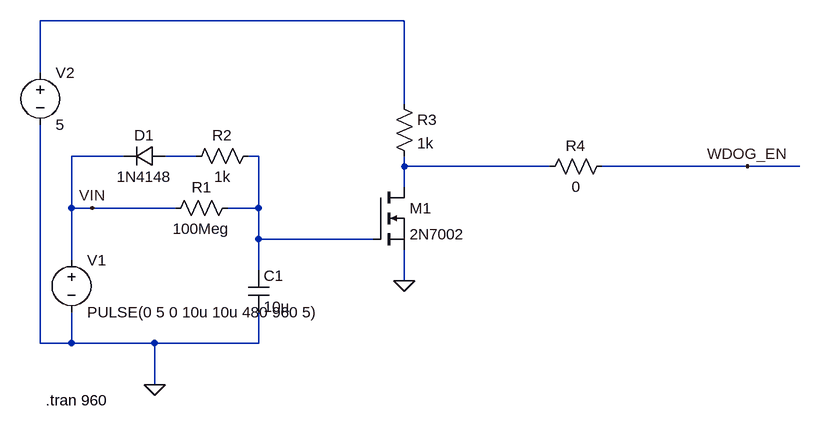
[diagram p0: schematic WDT fast deassert.asc]
WDT fast deassert.asc, the LTspice schematic file:
Version 4.1
SHEET 1 1172 680
WIRE 560 -224 0 -224
WIRE 0 -144 0 -224
WIRE 560 -96 560 -224
WIRE 128 -16 48 -16
WIRE 240 -16 192 -16
WIRE 336 -16 320 -16
WIRE 560 0 560 -16
WIRE 784 0 560 0
WIRE 1088 0 864 0
WIRE 1168 0 1088 0
WIRE 560 32 560 0
WIRE 48 64 48 -16
WIRE 80 64 48 64
WIRE 208 64 80 64
WIRE 336 64 336 -16
WIRE 336 64 288 64
WIRE 336 112 336 64
WIRE 512 112 336 112
WIRE 48 144 48 64
WIRE 336 160 336 112
WIRE 560 176 560 128
WIRE 0 272 0 -64
WIRE 48 272 48 224
WIRE 48 272 0 272
WIRE 176 272 48 272
WIRE 336 272 336 224
WIRE 336 272 176 272
WIRE 176 336 176 272
FLAG 176 336 0
FLAG 560 176 0
FLAG 1088 0 WDOG_EN
FLAG 80 64 VIN
SYMBOL voltage 48 128 R0
WINDOW 123 0 0 Left 0
WINDOW 39 0 0 Left 0
SYMATTR InstName V1
SYMATTR Value PULSE(0 5 0 10u 10u 480 960 5)
SYMBOL res 304 48 R90
WINDOW 0 0 56 VBottom 2
WINDOW 3 32 56 VTop 2
SYMATTR InstName R1
SYMATTR Value 100Meg
SYMBOL cap 320 160 R0
SYMATTR InstName C1
SYMATTR Value 10µ
SYMBOL diode 192 -32 R90
WINDOW 0 0 32 VBottom 2
WINDOW 3 32 32 VTop 2
SYMATTR InstName D1
SYMATTR Value 1N4148
SYMBOL res 336 -32 R90
WINDOW 0 0 56 VBottom 2
WINDOW 3 32 56 VTop 2
SYMATTR InstName R2
SYMATTR Value 1k
SYMBOL nmos 512 32 R0
SYMATTR InstName M1
SYMATTR Value 2N7002
SYMBOL res 544 -112 R0
SYMATTR InstName R3
SYMATTR Value 1k
SYMBOL voltage 0 -160 R0
WINDOW 123 0 0 Left 0
WINDOW 39 0 0 Left 0
SYMATTR InstName V2
SYMATTR Value 5
SYMBOL res 880 -16 R90
WINDOW 0 0 56 VBottom 2
WINDOW 3 32 56 VTop 2
SYMATTR InstName R4
SYMATTR Value 0
TEXT 8 360 Left 2 !.tran 960

The netlist it stands for:
* WDT fast deassert.asc
V1 VIN 0 PULSE(0 5 0 10u 10u 480 960 5)
R1 N003 VIN 100Meg
C1 N003 0 10µ
D1 N002 VIN 1N4148
R2 N003 N002 1k
M1 N004 N003 0 0 2N7002
R3 N001 N004 1k
V2 N001 0 5
R4 WDOG_EN N004 0
.model D D
.lib standard.dio
.model NMOS NMOS
.model PMOS PMOS
.lib standard.mos
.tran 960
.backanno
.end